# EAGLE design M650X (EAGLE 6.6.0)
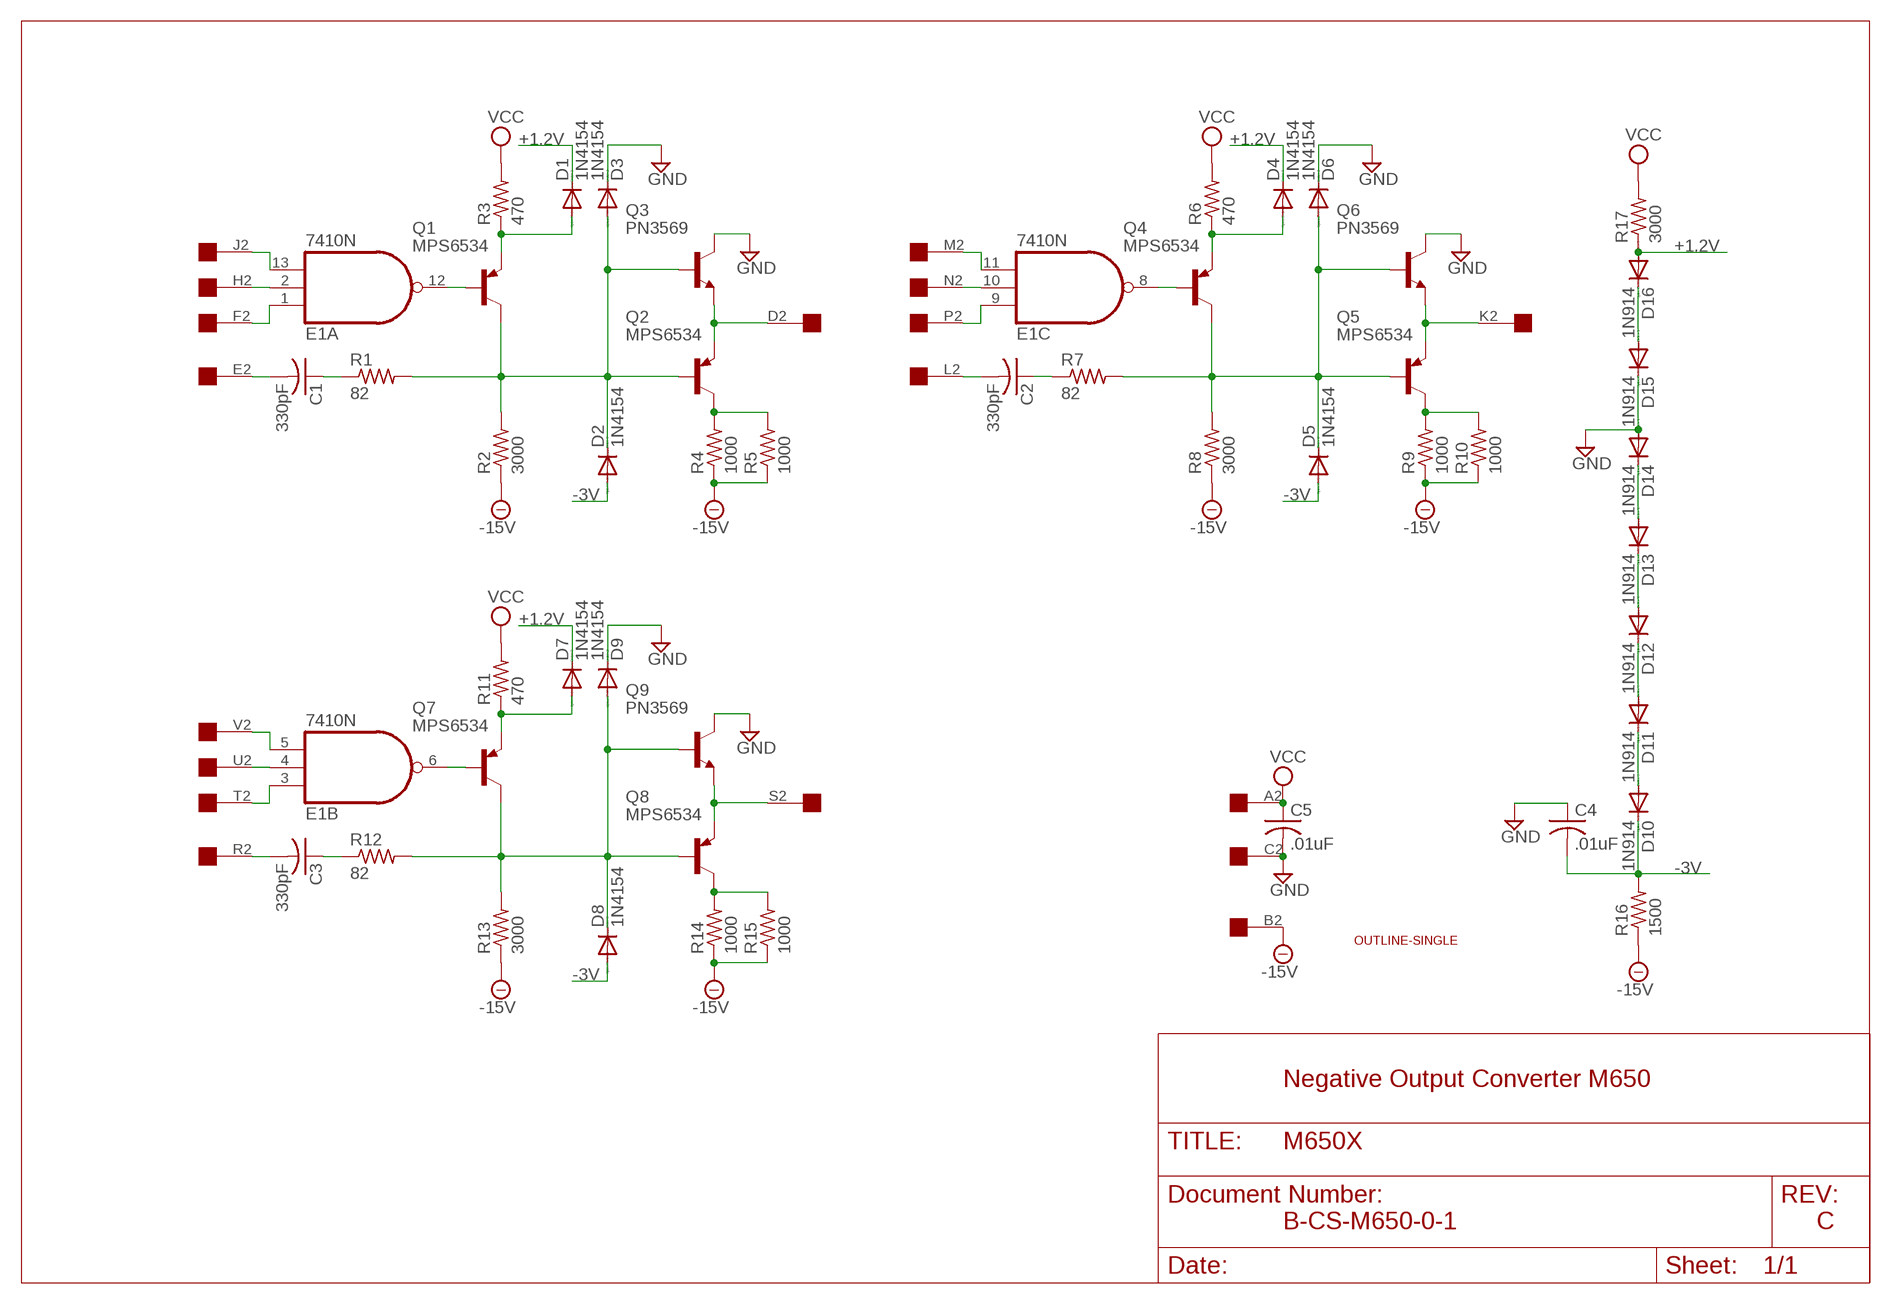
[diagram p0: schematic, sheet 1]

## Parts
C1  330pF  C-US050-025X075  [C050-025X075]
C2  330pF  C-US050-025X075  [C050-025X075]
C3  330pF  C-US050-025X075  [C050-025X075]
C4  .01uF  C-US050-025X075  [C050-025X075]
C5  .01uF  C-US050-025X075  [C050-025X075]
D1  1N4154  1N4148DO35-10  [DO35-10]
D2  1N4154  1N4148DO35-10  [DO35-10]
D3  1N4154  1N4148DO35-10  [DO35-10]
D4  1N4154  1N4148DO35-10  [DO35-10]
D5  1N4154  1N4148DO35-10  [DO35-10]
D6  1N4154  1N4148DO35-10  [DO35-10]
D7  1N4154  1N4148DO35-10  [DO35-10]
D8  1N4154  1N4148DO35-10  [DO35-10]
D9  1N4154  1N4148DO35-10  [DO35-10]
D10  1N914  1N4148DO35-10  [DO35-10]
D11  1N914  1N4148DO35-10  [DO35-10]
D12  1N914  1N4148DO35-10  [DO35-10]
D13  1N914  1N4148DO35-10  [DO35-10]
D14  1N914  1N4148DO35-10  [DO35-10]
D15  1N914  1N4148DO35-10  [DO35-10]
D16  1N914  1N4148DO35-10  [DO35-10]
E1  7410N  [DIL14]
Q1  MPS6534  2N5415  [TO39]
Q2  MPS6534  2N5415  [TO39]
Q3  PN3569  2N2219  [TO5]
Q4  MPS6534  2N5415  [TO39]
Q5  MPS6534  2N5415  [TO39]
Q6  PN3569  2N2219  [TO5]
Q7  MPS6534  2N5415  [TO39]
Q8  MPS6534  2N5415  [TO39]
Q9  PN3569  2N2219  [TO5]
R1  82  R-US_0207/10  [0207/10]
R2  3000  R-US_0207/10  [0207/10]
R3  470  R-US_0207/10  [0207/10]
R4  1000  R-US_0207/10  [0207/10]
R5  1000  R-US_0207/10  [0207/10]
R6  470  R-US_0207/10  [0207/10]
R7  82  R-US_0207/10  [0207/10]
R8  3000  R-US_0207/10  [0207/10]
R9  1000  R-US_0207/10  [0207/10]
R10  1000  R-US_0207/10  [0207/10]
R11  470  R-US_0207/10  [0207/10]
R12  82  R-US_0207/10  [0207/10]
R13  3000  R-US_0207/10  [0207/10]
R14  1000  R-US_0207/10  [0207/10]
R15  1000  R-US_0207/10  [0207/10]
R16  1500  R-US_0207/10  [0207/10]
R17  3000  R-US_0207/10  [0207/10]
U$1  OUTLINE-SINGLE  [SINGLE]
U$3  EDGE-1  [EDGE-CON1]

## Nets
+1.2V [Supply]: D1.C D4.C D7.C D16.A R17.1
-3V [Supply]: C4.2 D2.A D5.A D8.A D10.C R16.2
-15V: R2.1 R4.1 R5.1 R8.1 R9.1 R10.1 R13.1 R14.1 R15.1 R16.1 U$3.B2
GND [Supply]: C4.1 C5.2 D3.C D6.C D9.C D14.A D15.C Q3.3(C) Q6.3(C) Q9.3(C) U$3.C2
N$1: E1.2(A:I1) U$3.H2
N$2: C1.2 U$3.E2
N$3: C1.1 R1.1
N$4: E1.12(A:O) Q1.2(B)
N$5: D1.A Q1.1(E) R3.1
N$6: D2.C D3.A Q1.3(C) Q2.2(B) Q3.2(B) R1.2 R2.2
N$7: Q2.1(E) Q3.1(E) U$3.D2
N$8: Q2.3(C) R4.2 R5.2
N$9: E1.9(C:I0) U$3.P2
N$10: E1.11(C:I2) U$3.M2
N$11: E1.10(C:I1) U$3.N2
N$12: E1.8(C:O) Q4.2(B)
N$13: D4.A Q4.1(E) R6.1
N$14: E1.1(A:I0) U$3.F2
N$15: E1.13(A:I2) U$3.J2
N$16: C2.2 U$3.L2
N$17: C2.1 R7.1
N$18: D5.C D6.A Q4.3(C) Q5.2(B) Q6.2(B) R7.2 R8.2
N$19: Q5.1(E) Q6.1(E) U$3.K2
N$20: Q5.3(C) R9.2 R10.2
N$21: E1.3(B:I0) U$3.T2
N$22: E1.5(B:I2) U$3.V2
N$23: E1.4(B:I1) U$3.U2
N$24: E1.6(B:O) Q7.2(B)
N$25: D7.A Q7.1(E) R11.1
N$26: C3.2 U$3.R2
N$27: C3.1 R12.1
N$28: D8.C D9.A Q7.3(C) Q8.2(B) Q9.2(B) R12.2 R13.2
N$29: Q8.1(E) Q9.1(E) U$3.S2
N$30: Q8.3(C) R14.2 R15.2
N$32 [Supply]: D10.A D11.C
N$33 [Supply]: D11.A D12.C
N$34 [Supply]: D12.A D13.C
N$35 [Supply]: D13.A D14.C
N$37 [Supply]: D15.A D16.C
VCC [Supply]: C5.1 R3.2 R6.2 R11.2 R17.2 U$3.A2

## Notes on the sheet
- Negative Output Converter M650
- B-CS-M650-0-1 | C

## Power pins joined to a net without a drawn wire
GND: E1.7(P:GND)
VCC: E1.14(P:VCC)

## Library data of the parts
C1-C5 = rcl:C-US: CAPACITOR, American symbol
D1-D16 = diode:1N4148: DIODE high speed (Philips)
E1 = 74xx-us:74*10: Triple 3-input NAND gate
Q1 Q2 Q4 Q5 Q7 Q8 = transistor-pnp:2N5415*: PNP Transistror
Q3 Q6 Q9 = transistor-npn:2N2219: NPN Transistor
R1-R17 = rcl:R-US_: RESISTOR, American symbol
U$1 = dec-con:OUTLINE-*: Board outlines for DEC boards.
U$3 = dec-con:EDGE-1: Single-Sided DEC Edge Connector -- (side 2)

## Net classes
1 Supply: width 0.813 mm

## Board
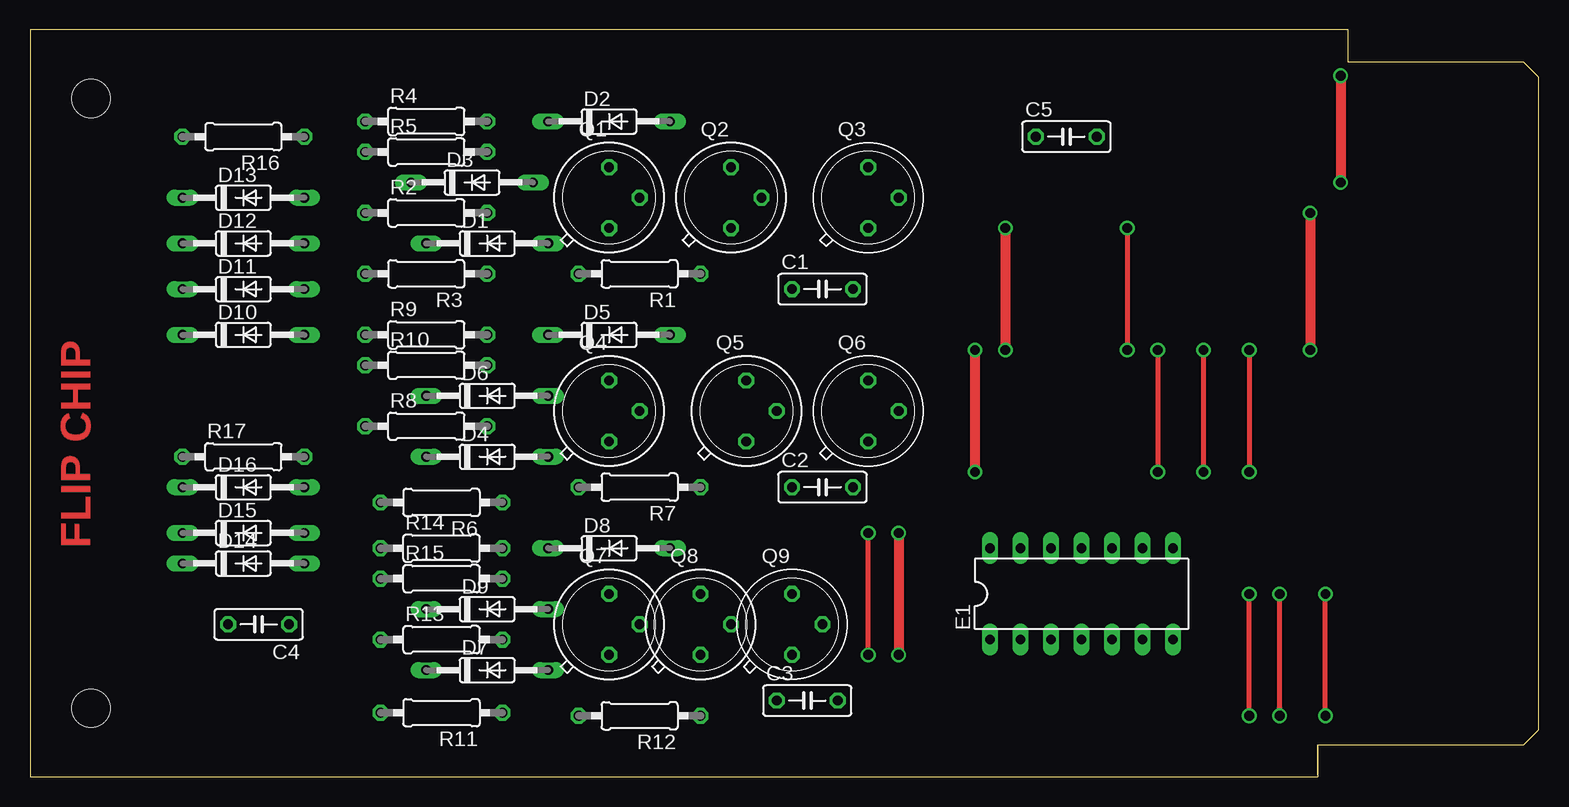
[diagram p1: board, top side]
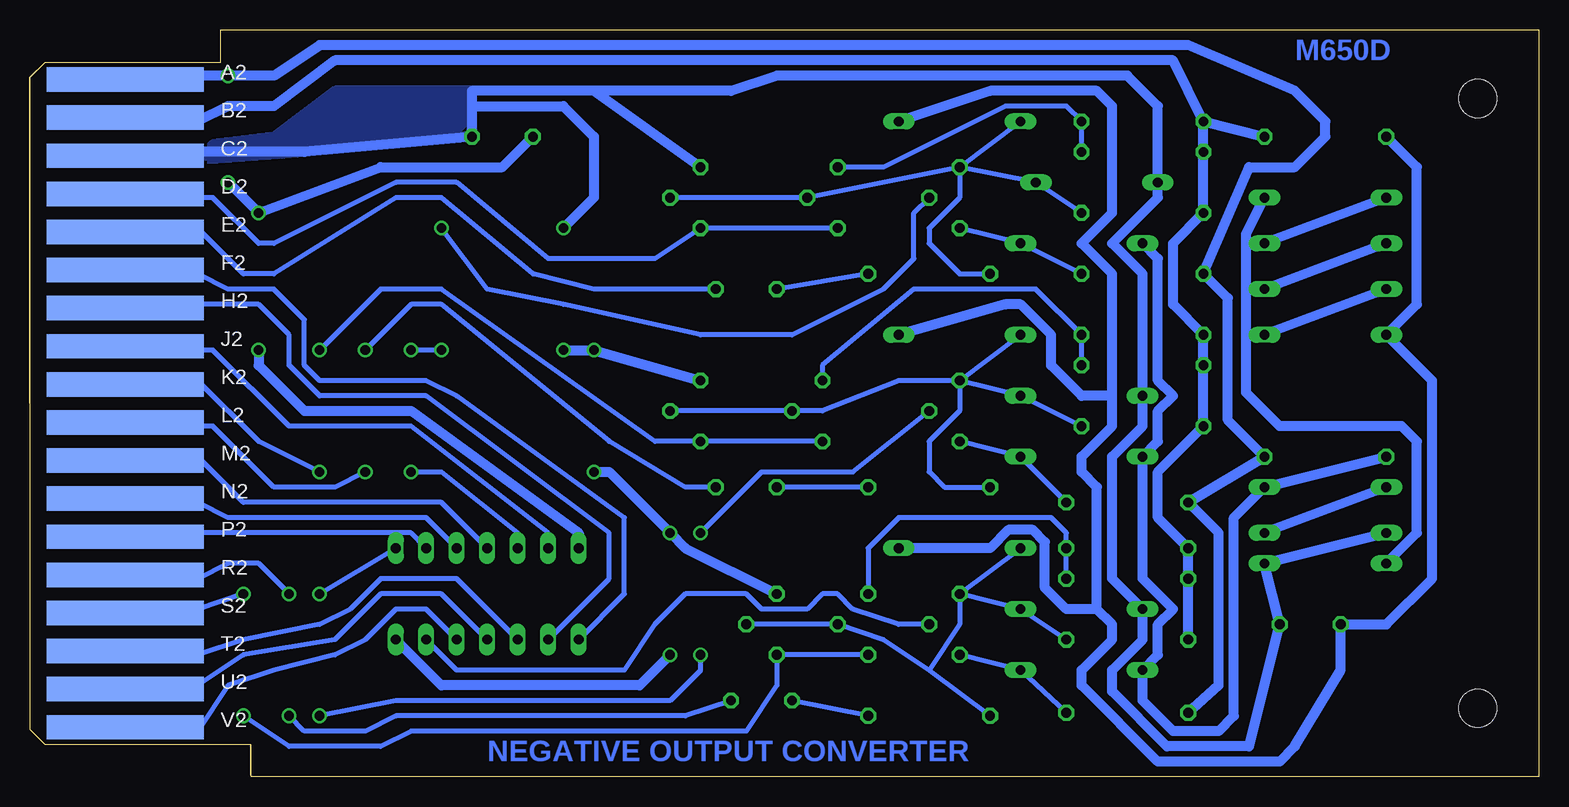
[diagram p2: board, bottom side, seen from below]

Size 125.73 x 62.23 mm. Coordinates in mm from the lower left corner, seen from the top.
Copper layers (1+16): Top 0.035mm / dielectric 1.5mm / Bottom 0.035mm
Design rules "16mils": minimum track width 16mil, minimum drill 32mil, track to track 15mil, track to pad 10mil, pad to pad 10mil, via to via 10mil, smd to smd 10mil, copper to edge 13mil, drill to drill 10mil, minimum pad ring 10mil, minimum via ring 8mil, stop-mask expansion 0mil, vias tented up to drill 0mil, thermal gap 10mil

### Footprints (pad centres in the part's own frame; a part is rotated, then mirrored left to right if it is on the bottom)
C050-025X075 = drill 0.813 octagon: 1 -2.54,0; 2 2.54,0
DO35-10 = drill 0.813 long: A 5.08,0; C -5.08,0
DIL14 = drill 0.813 long: 1 -7.62,-3.81; 2 -5.08,-3.81; 3 -2.54,-3.81; 4 0,-3.81; 5 2.54,-3.81; 6 5.08,-3.81; 7 7.62,-3.81; 8 7.62,3.81; 9 5.08,3.81; 10 2.54,3.81; 11 0,3.81; 12 -2.54,3.81; 13 -5.08,3.81; 14 -7.62,3.81
TO39 = drill 0.813 octagon: 1 0,-2.54; 2 2.54,0; 3 0,2.54
TO5 = drill 0.813 octagon: 1 0,-2.54; 2 2.54,0; 3 0,2.54
0207/10 = drill 0.813 octagon: 1 -5.08,0; 2 5.08,0
SINGLE = hole 3.175: 120.65,56.515; 120.65,5.715
EDGE-CON1 = smd 13.106 x 2.032 bottom: A2 7.938,4.128; B2 7.938,7.303; C2 7.938,10.477; D2 7.938,13.652; E2 7.938,16.828; F2 7.938,20.003; H2 7.938,23.177; J2 7.938,26.352; K2 7.938,29.527; L2 7.938,32.703; M2 7.938,35.877; N2 7.938,39.053; P2 7.938,42.227; R2 7.938,45.403; S2 7.938,48.578; T2 7.938,51.752; U2 7.938,54.928; V2 7.938,58.102

### Placement (x,y rotation side)
C1  66.04,40.64 0 top
C2  66.04,24.13 0 top
C3  64.77,6.35 0 top
C4  19.05,12.7 180 top
C5  86.36,53.34 0 top
D1  38.1,44.45 0 top
D2  48.26,54.61 0 top
D3  36.83,49.53 0 top
D4  38.1,26.67 0 top
D5  48.26,36.83 0 top
D6  38.1,31.75 0 top
D7  38.1,8.89 0 top
D8  48.26,19.05 0 top
D9  38.1,13.97 0 top
D10  17.78,36.83 0 top
D11  17.78,40.64 0 top
D12  17.78,44.45 0 top
D13  17.78,48.26 0 top
D14  17.78,17.78 0 top
D15  17.78,20.32 0 top
D16  17.78,24.13 0 top
E1  87.63,15.24 0 top
Q1  48.26,48.26 0 top
Q2  58.42,48.26 0 top
Q3  69.85,48.26 0 top
Q4  48.26,30.48 0 top
Q5  59.69,30.48 0 top
Q6  69.85,30.48 0 top
Q7  48.26,12.7 0 top
Q8  55.88,12.7 0 top
Q9  63.5,12.7 0 top
R1  50.8,41.91 180 top
R2  33.02,46.99 0 top
R3  33.02,41.91 180 top
R4  33.02,54.61 0 top
R5  33.02,52.07 0 top
R6  34.29,22.86 180 top
R7  50.8,24.13 180 top
R8  33.02,29.21 0 top
R9  33.02,36.83 0 top
R10  33.02,34.29 0 top
R11  34.29,5.33 180 top
R12  50.8,5.08 180 top
R13  34.29,11.43 0 top
R14  34.29,19.05 0 top
R15  34.29,16.51 0 top
R16  17.78,53.34 180 top
R17  17.78,26.67 0 top
U$1  125.73,62.23 180 top
U$2  [FLIPCHIP]  0,0 0 top
U$3  125.73,62.23 180 top

### Tracks (layer width: path | path; a pad name or v marks a point on that pad's centre or on a via)
+1.2V
  Bottom 0.813: R17.1 D16.A 25.4,21.59 25.4,5.08 26.67,3.81 30.48,3.81 33.02,6.35 D7.C 31.75,10.16 31.75,12.7 30.48,13.97 33.02,16.51 D4.C 31.75,27.94 31.75,30.48 30.48,31.75 31.75,33.02 31.75,43.18 D1.C
-3V
  Bottom 0.813: R16.2 10.16,50.8 10.16,39.37 D10.C 8.89,33.02 8.89,16.51 12.7,12.7 C4.2 16.51,8.89 20.32,2.54 21.59,1.27 31.75,1.27 38.1,7.62 38.1,8.89 35.56,11.43 35.56,12.7 36.83,13.97 | 36.83,13.97 39.37,13.97 41.15,15.75 41.15,19.56 42.16,20.57 44.2,20.57 45.72,19.05 D8.A | D2.A 45.72,57.15 36.83,57.15 35.56,55.88 35.56,46.99 38.1,44.45 35.56,41.91 35.56,31.75 | 35.56,31.75 35.56,29.21 38.1,26.67 38.1,25.4 36.83,24.13 36.83,13.97 | D5.A 44.45,39.37 43.18,39.37 40.64,36.83 40.64,34.29 38.1,31.75 35.56,31.75
-15V
  Bottom 0.813: U$3.B2 116.84,54.61 111.76,54.61 109.22,55.88 105.41,55.88 100.33,59.69 30.48,59.69 R4.1 | R4.1 R16.1 | R4.1 R5.1 R2.1 30.48,44.45 30.48,39.37 R9.1 R10.1 R8.1 31.75,25.4 31.75,21.59 R14.1 R15.1 R13.1
GND  (via drill 0.81)
  Top 0.813: v72.39,20.32 v72.39,10.16 | v78.74,35.56 v78.74,25.4 | v81.28,45.72 v81.28,35.56
  Bottom 0.813: E1.7 91.44,7.62 74.93,7.62 v72.39,10.16 | Q9.3 71.12,19.05 v72.39,20.32 77.47,25.4 v78.74,25.4 | v81.28,35.56 v78.74,35.56 Q6.3 | U$3.C2 116.84,52.07 102.87,52.07 C5.2 88.9,55.88 | v81.28,45.72 78.74,48.26 78.74,53.34 81.28,55.88 88.9,55.88 | 88.9,55.88 88.9,57.15 78.74,57.15 | 78.74,57.15 Q3.3 | D15.C D14.A C4.1 24.13,2.54 30.99,2.54 35.56,7.11 35.56,8.89 33.02,11.43 D9.C 35.56,16.51 35.56,26.67 33.02,29.21 D6.C 33.02,41.91 35.56,44.45 31.75,48.26 D3.C 31.75,55.88 34.29,58.42 63.5,58.42 67.31,57.15 78.74,57.15
  pour Bottom: 111.76,51.44 102.87,52.07 88.9,53.34 88.9,57.15 100.33,57.15 105.41,53.34 110.49,52.7
N$1
  Bottom 0.406: E1.2 77.47,16.51 77.47,20.32 92.71,31.75 101.6,31.75 104.14,34.29 104.14,36.83 106.68,39.37 116.84,39.37 U$3.H2
N$2
  Bottom 0.406: U$3.E2 116.84,45.72 111.76,45.72 107.95,41.91 105.41,41.91 95.25,48.26 91.44,48.26 83.82,41.91 78.74,40.64 C1.2
N$3
  Bottom 0.406: R1.1 C1.1
N$4  (via drill 0.81)
  Top 0.406: v93.98,35.56 v93.98,25.4 | v91.44,45.72 v91.44,35.56
  Bottom 0.406: E1.12 85.09,20.32 91.44,25.4 v93.98,25.4 | v91.44,35.56 v93.98,35.56 | v91.44,45.72 87.63,40.64 81.28,39.37 69.85,36.83 62.23,36.83 54.61,40.64 52.07,43.18 52.07,46.99 Q1.2
N$5
  Bottom 0.406: R3.1 D1.A Q1.1
N$6
  Bottom 0.406: R2.2 D3.A Q1.3 | Q1.3 D2.C | Q1.3 Q2.2 Q3.2 | R1.2 48.26,41.91 50.8,44.45 50.8,45.72 48.26,48.26 Q1.3
N$7
  Bottom 0.406: U$3.D2 116.84,48.26 110.49,48.26 106.68,44.45 105.41,44.45 95.25,49.53 90.17,49.53 82.55,43.18 73.66,43.18 Q3.1 Q2.1
N$8
  Bottom 0.406: R5.2 R4.2 39.37,55.88 44.45,55.88 54.61,50.8 Q2.3
N$9
  Bottom 0.406: E1.9 93.98,20.32 116.84,20.32 U$3.P2
N$10
  Bottom 0.406: U$3.M2 111.76,26.67 107.95,22.86 91.44,22.86 E1.11
N$11
  Bottom 0.406: E1.10 92.71,21.59 109.22,21.59 111.76,22.86 116.84,22.86 U$3.N2
N$12  (via drill 0.81)
  Top 0.406: v101.6,5.08 v101.6,15.24 | v69.85,10.16 v69.85,20.32
  Bottom 0.406: v101.6,15.24 E1.8 | v101.6,5.08 95.25,6.35 72.39,6.35 69.85,8.89 v69.85,10.16 | Q4.2 57.15,25.4 64.77,25.4 v69.85,20.32
N$13
  Bottom 0.406: R6.1 D4.A Q4.1
N$14
  Bottom 0.406: U$3.F2 116.84,41.91 111.76,41.91 109.22,40.64 105.41,40.64 102.87,38.1 102.87,34.29 101.6,33.02 92.71,33.02 90.17,31.75 76.2,21.59 76.2,15.24 E1.1
N$15
  Bottom 0.406: U$3.J2 116.84,35.56 110.49,35.56 104.14,29.21 93.98,29.21 82.55,20.32 E1.13
N$16  (via drill 0.81)
  Top 0.406: v97.79,35.56 v97.79,25.4
  Bottom 0.406: U$3.L2 116.84,29.21 110.49,29.21 105.41,24.13 100.33,24.13 v97.79,25.4 | C2.2 71.12,24.13 77.47,27.94 91.44,39.37 93.98,39.37 v97.79,35.56
N$17
  Bottom 0.406: R7.1 C2.1
N$18
  Bottom 0.406: Q6.2 Q5.2 59.69,30.48 53.34,33.02 Q4.3 | R7.2 49.53,24.13 50.8,25.4 50.8,27.94 48.26,30.48 Q4.3 | Q4.3 D5.C | Q4.3 D6.A R8.2
N$19  (via drill 0.81)
  Top 0.406: v101.6,35.56 v101.6,25.4
  Bottom 0.406: U$3.K2 116.84,33.02 111.76,33.02 106.68,27.94 v101.6,25.4 | Q5.1 Q6.1 73.66,27.94 91.44,40.64 96.52,40.64 v101.6,35.56
N$20
  Bottom 0.406: Q5.3 59.69,34.29 52.07,40.64 41.91,40.64 R9.2 R10.2
N$21
  Bottom 0.406: U$3.T2 116.84,10.16 111.76,10.16 107.95,11.43 101.6,12.7 99.06,13.97 96.52,16.51 90.17,16.51 E1.3
N$22
  Bottom 0.406: U$3.V2 116.84,3.81 111.76,3.81 109.22,7.62 105.41,8.89 100.33,10.16 97.79,11.43 95.25,13.97 92.71,13.97 E1.5
N$23
  Bottom 0.406: U$3.U2 116.84,7.62 111.76,7.62 107.95,10.16 100.33,11.43 96.52,15.24 91.44,15.24 E1.4
N$24
  Bottom 0.406: E1.6 90.17,8.89 76.2,8.89 73.66,12.7 71.12,15.24 66.04,15.24 64.77,13.97 60.96,13.97 59.69,15.24 58.42,15.24 57.15,13.97 53.34,12.7 Q7.2
N$25
  Bottom 0.406: Q7.1 D7.A R11.1
N$26  (via drill 0.81)
  Top 0.406: v104.14,5.08 v104.14,15.24
  Bottom 0.406: U$3.R2 116.84,16.51 111.76,16.51 109.22,17.78 106.68,17.78 v104.14,15.24 | v104.14,5.08 102.87,3.81 97.79,3.81 95.25,5.08 71.12,5.08 C3.2
N$27
  Bottom 0.406: R12.1 C3.1
N$28
  Bottom 0.406: Q9.2 Q8.2 54.61,11.43 50.8,8.89 | 50.8,8.89 48.26,12.7 Q7.3 | 50.8,8.89 R12.2 | R13.2 D9.A Q7.3 | Q7.3 D8.C
N$29  (via drill 0.81)
  Top 0.406: v107.95,5.08 v107.95,15.24
  Bottom 0.406: U$3.S2 116.84,13.97 111.76,13.97 v107.95,15.24 | v107.95,5.08 104.14,2.54 96.52,2.54 93.98,3.81 66.04,3.81 63.5,7.62 Q9.1 Q8.1
N$30
  Bottom 0.406: R14.2 R15.2 39.37,20.32 40.64,21.59 53.34,21.59 55.88,19.05 Q8.3
N$32
  Bottom 0.813: D11.C D10.A
N$33
  Bottom 0.813: D12.C D11.A
N$34
  Bottom 0.813: D13.C D12.A
N$35
  Bottom 0.813: D13.A 24.38,45.21 24.38,32 21.59,29.21 11.43,29.21 10.16,27.94 10.16,20.32 D14.C
N$37
  Bottom 0.813: D16.C D15.A
VCC  (via drill 0.81)
  Top 0.813: v106.68,46.99 v106.68,35.56 | v109.22,58.42 v109.22,49.53
  Bottom 0.813: U$3.A2 117.22,58.04 116.84,58.42 v109.22,58.42 105.41,58.42 101.6,60.96 29.21,60.96 20.32,57.15 17.78,54.61 17.78,53.34 20.32,50.8 24.13,50.8 R3.2 25.91,39.88 25.91,29.72 R17.2 R6.2 26.67,20.32 26.67,7.62 R11.2 | E1.14 80.01,20.32 93.98,30.48 102.87,30.48 106.68,34.29 v106.68,35.56 | v109.22,49.53 v106.68,46.99 96.52,50.8 86.36,50.8 C5.1

### Text on the board
Bottom: M650D | NEGATIVE OUTPUT CONVERTER